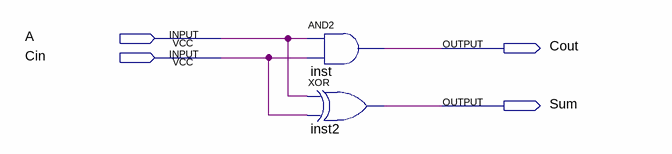
[diagram p0: schematic sheet]
// Quartus schematic HalfAdder.bdf as structural Verilog: 2 symbols, 4 pins
module HalfAdder (
  input  A,
  input  Cin,
  output Cout,
  output Sum
);

  and inst (Cout, A, Cin);
  xor inst2 (Sum, A, Cin);
endmodule
